# EasyEDA schematic SCH_MAX153_interceptor_2023-03-22.json
TITLE: Sheet_1; REV: 1.0; Date: 2023-03-22; Sheet: 1/1; Drawn By: raphael.boichot; Company: Your Company
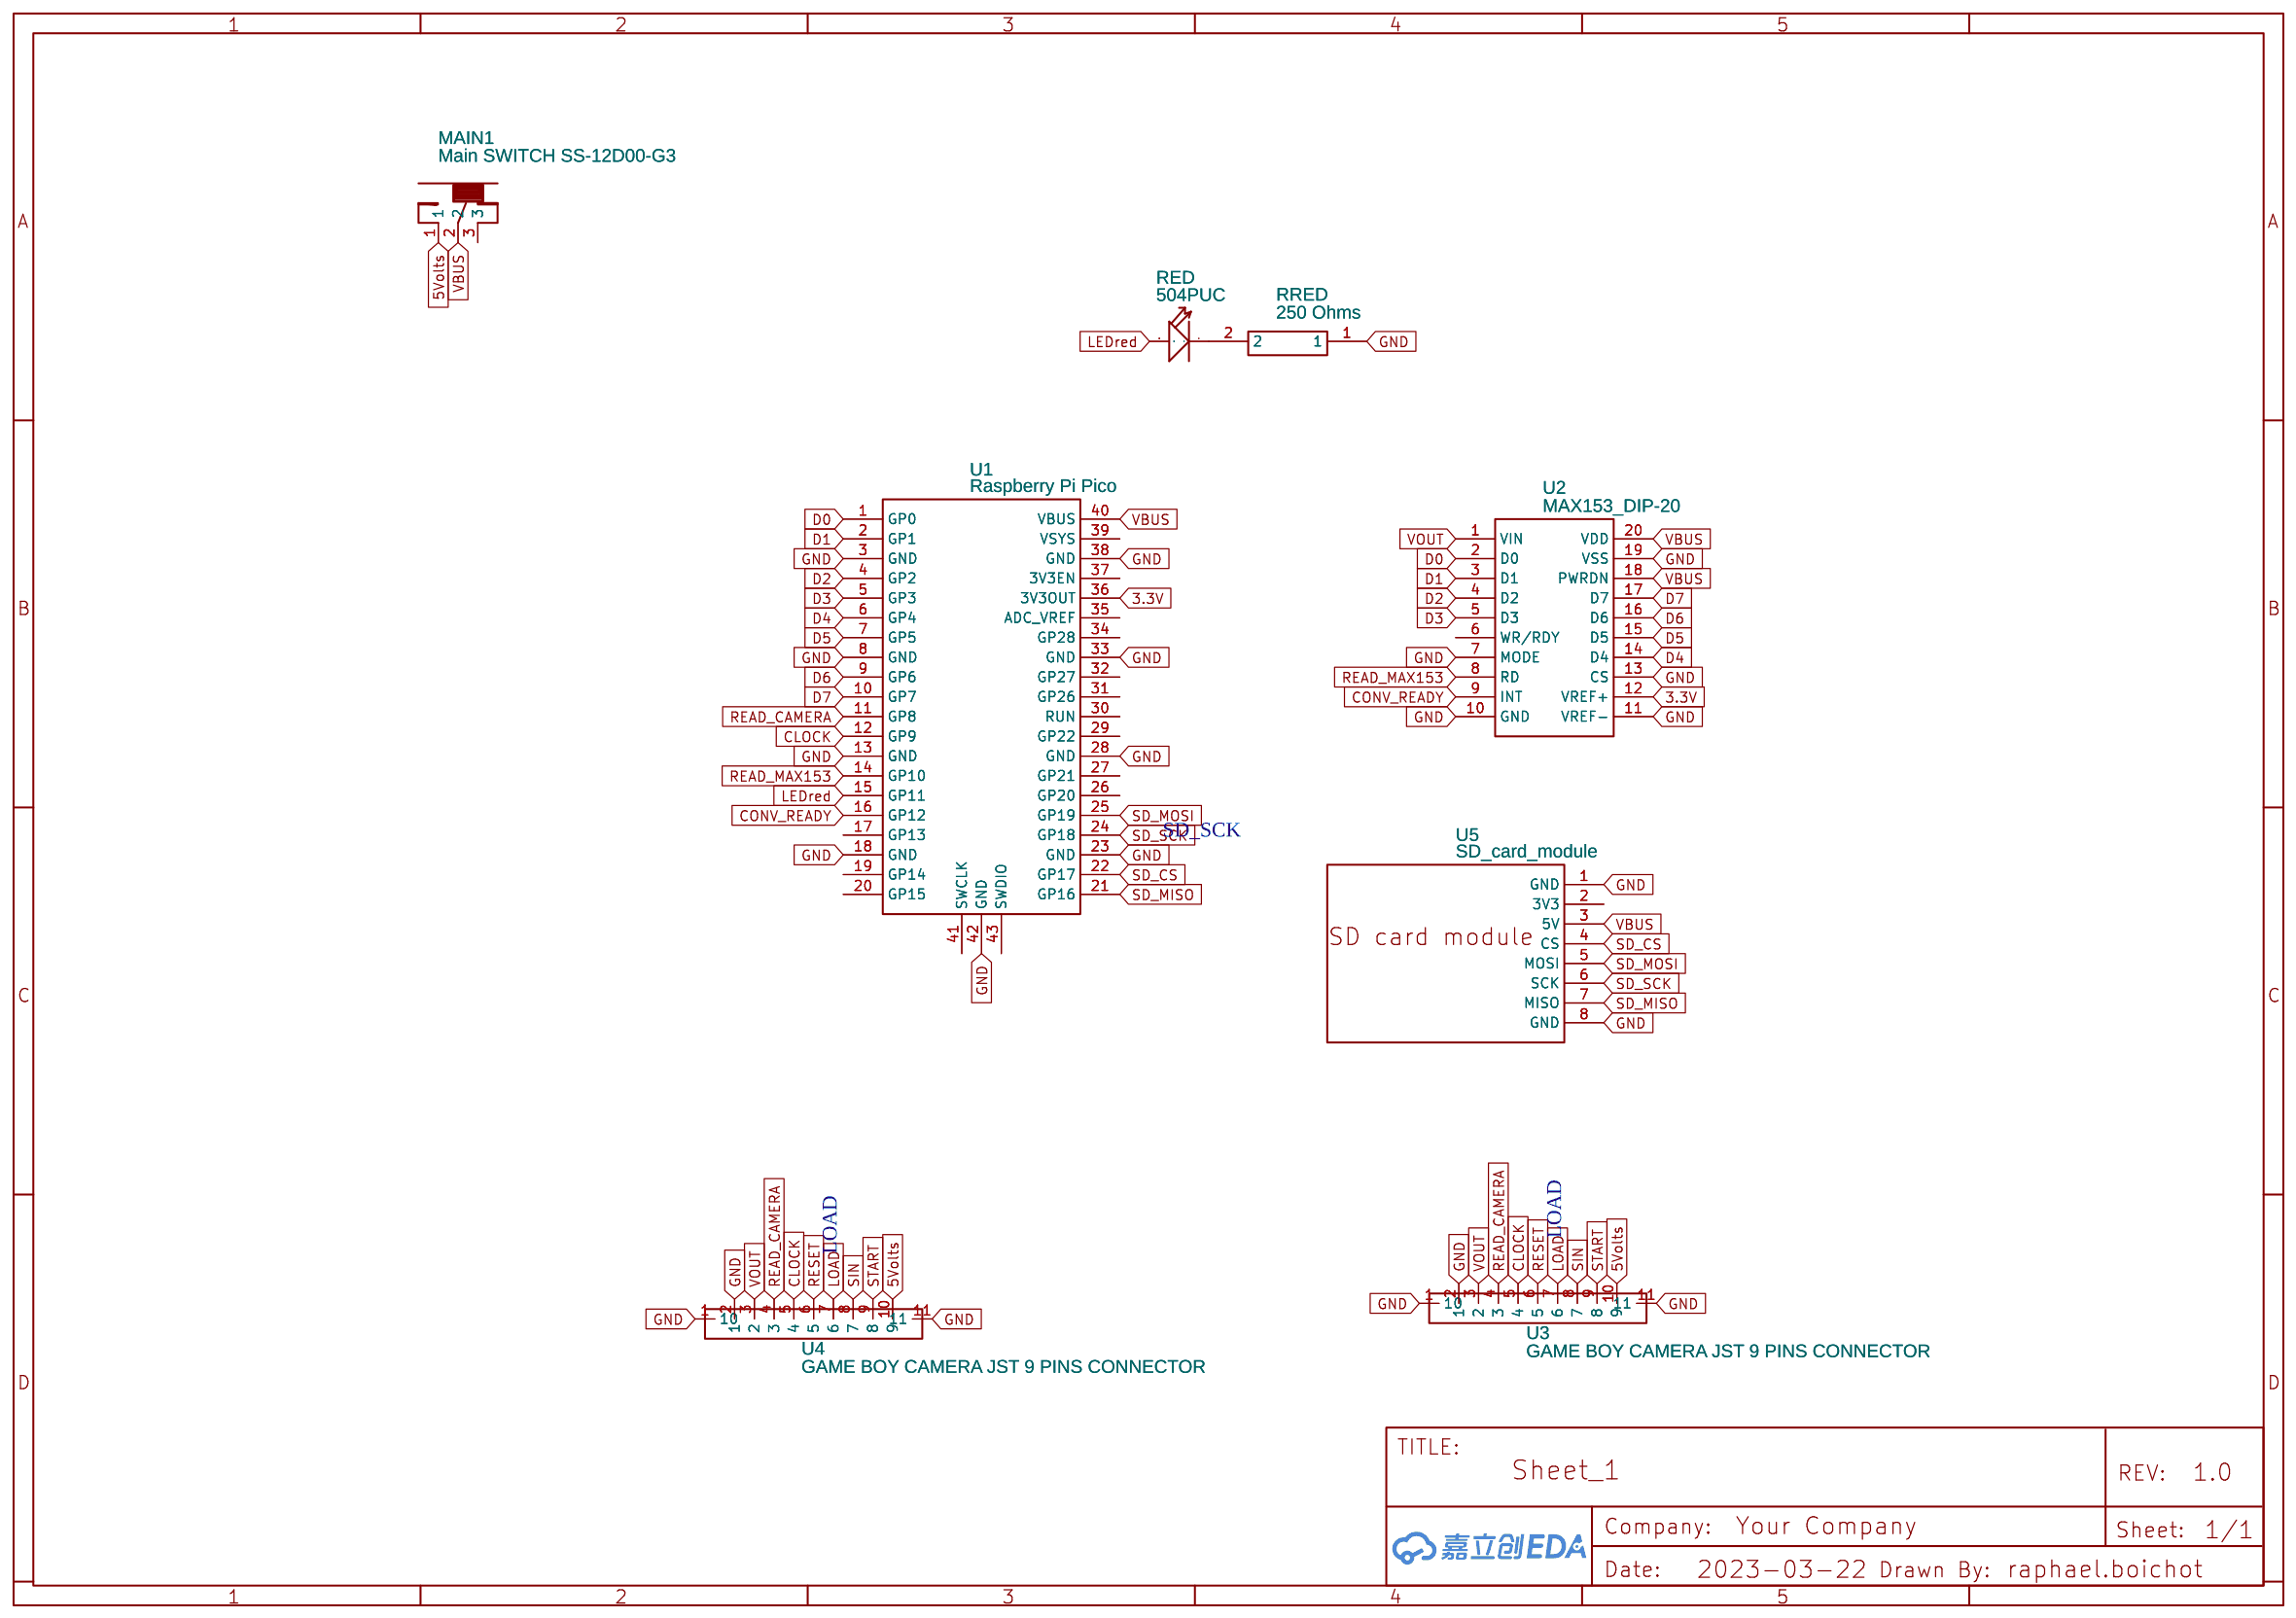
[diagram p0: schematic sheet]

## Parts
MAIN1  Main SWITCH SS-12D00-G3  [TOGGLE SWITCH SS-12D00-G3]
RED  504PUC  [LED2-2.54-D5.0MM]
RRED  250 Ohms  [RESISTOR]
U1  Raspberry Pi Pico  [RASPBERRY-PI-PICO]
U2  MAX153_DIP-20  [MAX153_DIP-20]
U3  GAME BOY CAMERA JST 9 PINS CONNECTOR  [GAME BOY CAMERA JST 9 PINS CONNECTOR]
U4  GAME BOY CAMERA JST 9 PINS CONNECTOR  [GAME BOY CAMERA JST 9 PINS CONNECTOR]
U5  SD_card_module  [SD_CARD_MODULE]

## Library data of the parts
MAIN1 = TOGGLE SWITCH SS-12D00-G3: Supplier: aliexpress; Manufacturer: Dailywell; Contributor: Gibo222; link: https://de.aliexpress.com/item/32756772435.html?spm=a2g0o.productlist.0.0.4e077708sX2Al2&algo_pvid=716abed2-2433-4a4c-8d27-293a4e4961c2&algo_expid=716abed2-2433-4a4c-8d27-293a4e4961c2-8&btsid=2100bddd16119266912771087e59d6&ws_ab_test=searchweb0_0,searchweb201602_,searchweb201603_
RED = 504PUC: DIP LED Transparent-Purple-5mm;
RRED = RESITOR: Contributor: rander
U1 = Raspberry Pi Pico: Contributor: ostrander.jm
U2 = MAX153_DIP-20: Contributor: raphael.boichot
U3 U4 = GAME BOY CAMERA JST 9 PINS CONNECTOR: Contributor: raphael.boichot
U5 = SD_card_module: Contributor: raphael.boichot

## Nets
3.3V: U1.36(3V3OUT) U2.12(VREF+)
5Volts: MAIN1.1 U3.10(9) U4.10(9)
GND: RRED.1 U1.3(GND) U1.8(GND) U1.13(GND) U1.18(GND) U1.23(GND) U1.28(GND) U1.33(GND) U1.38(GND) U1.42(GND) U2.7(MODE) U2.10(GND) U2.11(VREF-) U2.13(CS) U2.19(VSS) U3.1(10) U3.2(1) U3.11 U4.1(10) U4.2(1) U4.11 U5.1(GND) U5.8(GND)
VBUS: MAIN1.2 U1.40(VBUS) U2.18(PWRDN) U2.20(VDD) U5.3(5V)
CLOCK: U1.12(GP9) U3.5(4) U4.5(4)
CONV_READY: U1.16(GP12) U2.9(INT)
D0: U1.1(GP0) U2.2(D0)
D1: U1.2(GP1) U2.3(D1)
D2: U1.4(GP2) U2.4(D2)
D3: U1.5(GP3) U2.5(D3)
D4: U1.6(GP4) U2.14(D4)
D5: U1.7(GP5) U2.15(D5)
D6: U1.9(GP6) U2.16(D6)
D7: U1.10(GP7) U2.17(D7)
LEDred: RED.+ U1.15(GP11)
LOAD: U3.7(6) U4.7(6)
READ_CAMERA: U1.11(GP8) U3.4(3) U4.4(3)
READ_MAX153: U1.14(GP10) U2.8(RD)
RESET: U3.6(5) U4.6(5)
SD_CS: U1.22(GP17) U5.4(CS)
SD_MISO: U1.21(GP16) U5.7(MISO)
SD_MOSI: U1.25(GP19) U5.5(MOSI)
SD_SCK: U1.24(GP18) U5.6(SCK)
SIN: U3.8(7) U4.8(7)
START: U3.9(8) U4.9(8)
VOUT: U2.1(VIN) U3.3(2) U4.3(2)
Net-(RED--): RED.- RRED.2

Not connected (* = marked no-connect by the designer): MAIN1 3; U1 17(GP13) 19(GP14) 20(GP15) 26(GP20) 27(GP21) 29(GP22) 30(RUN) 31(GP26) 32(GP27) 34(GP28) 35(ADC_VREF) 37(3V3EN) 39(VSYS) 41(SWCLK) 43(SWDIO); U2 6(WR/RDY); U5 2(3V3)

## Notes on the sheet
- SD_SCK
- LOAD
- LOAD
